# Altium project WT-32 V3.3 LCD.PrjPcb (part 1 of 3)
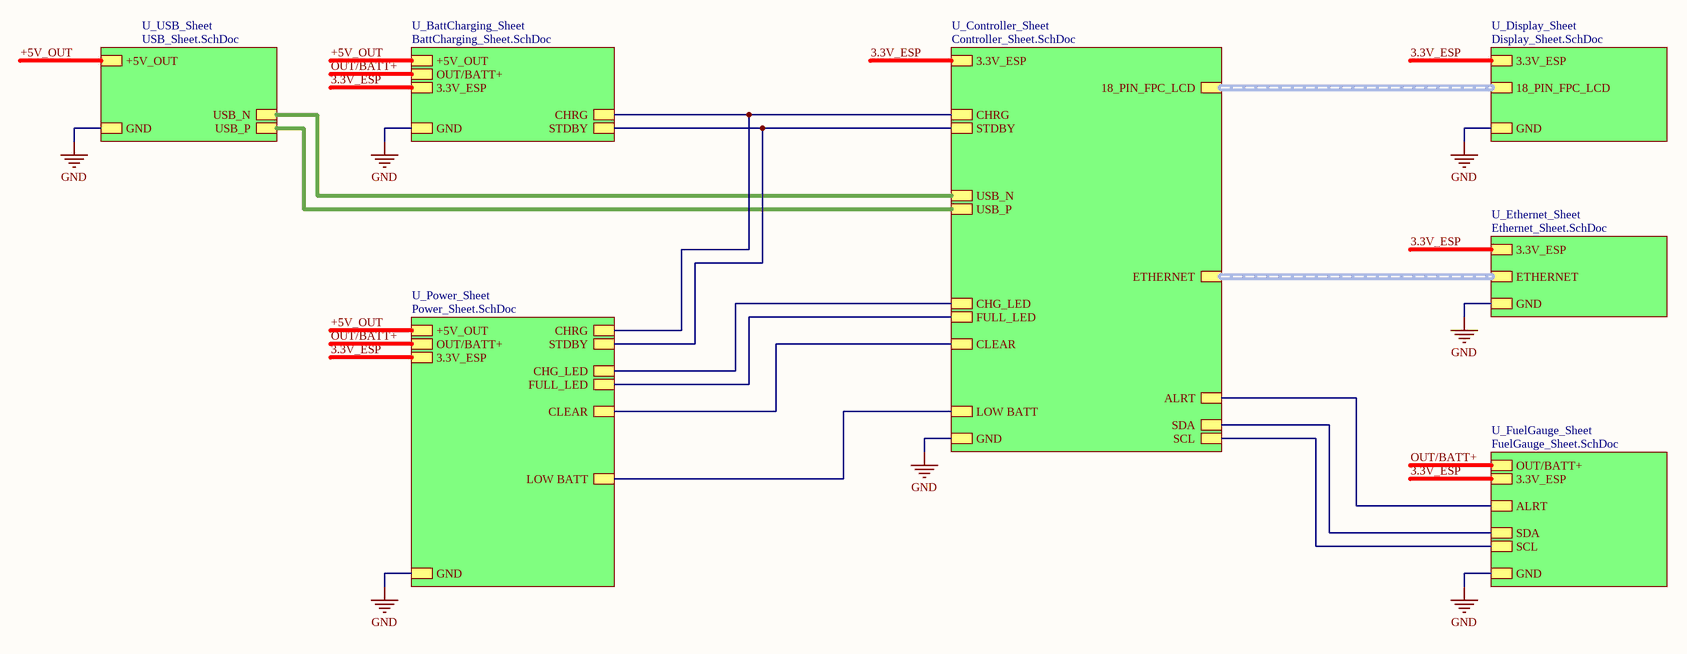
[diagram p0: Top_Sheet.SchDoc]
8 sheets, 129 parts. Net scope: hierarchical (ports join the sheet entries above them; power ports are global).
Board file: Webbie-V3.3.PcbDoc
Sheets:
  Top_Sheet.SchDoc
    U_BattCharging_Sheet = BattCharging_Sheet.SchDoc
    U_Controller_Sheet = Controller_Sheet.SchDoc
    U_Display_Sheet = Display_Sheet.SchDoc
    U_Ethernet_Sheet = Ethernet_Sheet.SchDoc
    U_FuelGauge_Sheet = FuelGauge_Sheet.SchDoc
    U_Power_Sheet = Power_Sheet.SchDoc
    U_USB_Sheet = USB_Sheet.SchDoc

## Sheet Top_Sheet.SchDoc: Top Sheet
size 420 x 297 mm; Engineer: Zain Siddiqui; Revision: V1.0; SheetNumber: 1; SheetTotal: 8

### Sub-sheets
U_BattCharging_Sheet = BattCharging_Sheet.SchDoc: +5V_OUT, GND, OUT/BATT+, 3.3V_ESP, CHRG, STDBY
U_Controller_Sheet = Controller_Sheet.SchDoc: CHRG, STDBY, CHG_LED, FULL_LED, CLEAR, LOW BATT, GND, 3.3V_ESP, 18_PIN_FPC_LCD (harness 18_PIN_FPC_LCD), ALRT, SDA, SCL, ETHERNET (harness ETHERNET), USB_N, USB_P
U_Display_Sheet = Display_Sheet.SchDoc: 18_PIN_FPC_LCD (harness 18_PIN_FPC_LCD), GND, 3.3V_ESP
U_Ethernet_Sheet = Ethernet_Sheet.SchDoc: ETHERNET (harness ETHERNET), GND, 3.3V_ESP
U_FuelGauge_Sheet = FuelGauge_Sheet.SchDoc: ALRT, SDA, SCL, GND, OUT/BATT+, 3.3V_ESP
U_Power_Sheet = Power_Sheet.SchDoc: CHRG, STDBY, +5V_OUT, GND, OUT/BATT+, 3.3V_ESP, CHG_LED, FULL_LED, CLEAR, LOW BATT
U_USB_Sheet = USB_Sheet.SchDoc: USB_N, USB_P, +5V_OUT, GND

### Nets
3.3V_ESP: sheet U_BattCharging_Sheet/3.3V_ESP, sheet U_Controller_Sheet/3.3V_ESP, sheet U_Display_Sheet/3.3V_ESP, sheet U_Ethernet_Sheet/3.3V_ESP, sheet U_FuelGauge_Sheet/3.3V_ESP, sheet U_Power_Sheet/3.3V_ESP
+5V_OUT: sheet U_BattCharging_Sheet/+5V_OUT, sheet U_Power_Sheet/+5V_OUT, sheet U_USB_Sheet/+5V_OUT
GND: sheet U_BattCharging_Sheet/GND, sheet U_Controller_Sheet/GND, sheet U_Display_Sheet/GND, sheet U_Ethernet_Sheet/GND, sheet U_FuelGauge_Sheet/GND, sheet U_Power_Sheet/GND, sheet U_USB_Sheet/GND
OUT/BATT+: sheet U_BattCharging_Sheet/OUT/BATT+, sheet U_FuelGauge_Sheet/OUT/BATT+, sheet U_Power_Sheet/OUT/BATT+
ALRT: sheet U_Controller_Sheet/ALRT, sheet U_FuelGauge_Sheet/ALRT
CHG_LED: sheet U_Controller_Sheet/CHG_LED, sheet U_Power_Sheet/CHG_LED
CHRG: sheet U_BattCharging_Sheet/CHRG, sheet U_Controller_Sheet/CHRG, sheet U_Power_Sheet/CHRG
CLEAR: sheet U_Controller_Sheet/CLEAR, sheet U_Power_Sheet/CLEAR
FULL_LED: sheet U_Controller_Sheet/FULL_LED, sheet U_Power_Sheet/FULL_LED
LOW BATT: sheet U_Controller_Sheet/LOW BATT, sheet U_Power_Sheet/LOW BATT
SCL: sheet U_Controller_Sheet/SCL, sheet U_FuelGauge_Sheet/SCL
SDA: sheet U_Controller_Sheet/SDA, sheet U_FuelGauge_Sheet/SDA
STDBY: sheet U_BattCharging_Sheet/STDBY, sheet U_Controller_Sheet/STDBY, sheet U_Power_Sheet/STDBY
USB_N: sheet U_Controller_Sheet/USB_N, sheet U_USB_Sheet/USB_N
USB_P: sheet U_Controller_Sheet/USB_P, sheet U_USB_Sheet/USB_P

### Buses and harness runs
harness sheet U_Controller_Sheet/18_PIN_FPC_LCD = sheet U_Display_Sheet/18_PIN_FPC_LCD
harness sheet U_Controller_Sheet/ETHERNET = sheet U_Ethernet_Sheet/ETHERNET

### Notes on the sheet
- PROJECT
- TITLE
- DATE
- FILE NAME
- A3
- SIZE
- ENGINEER
- SHEET
- REV
- OF

## Sheet BattCharging_Sheet.SchDoc: Charging Circuit
size 420 x 297 mm; Engineer: Zain Siddiqui; Revision: V1.0; SheetNumber: 3; SheetTotal: 8
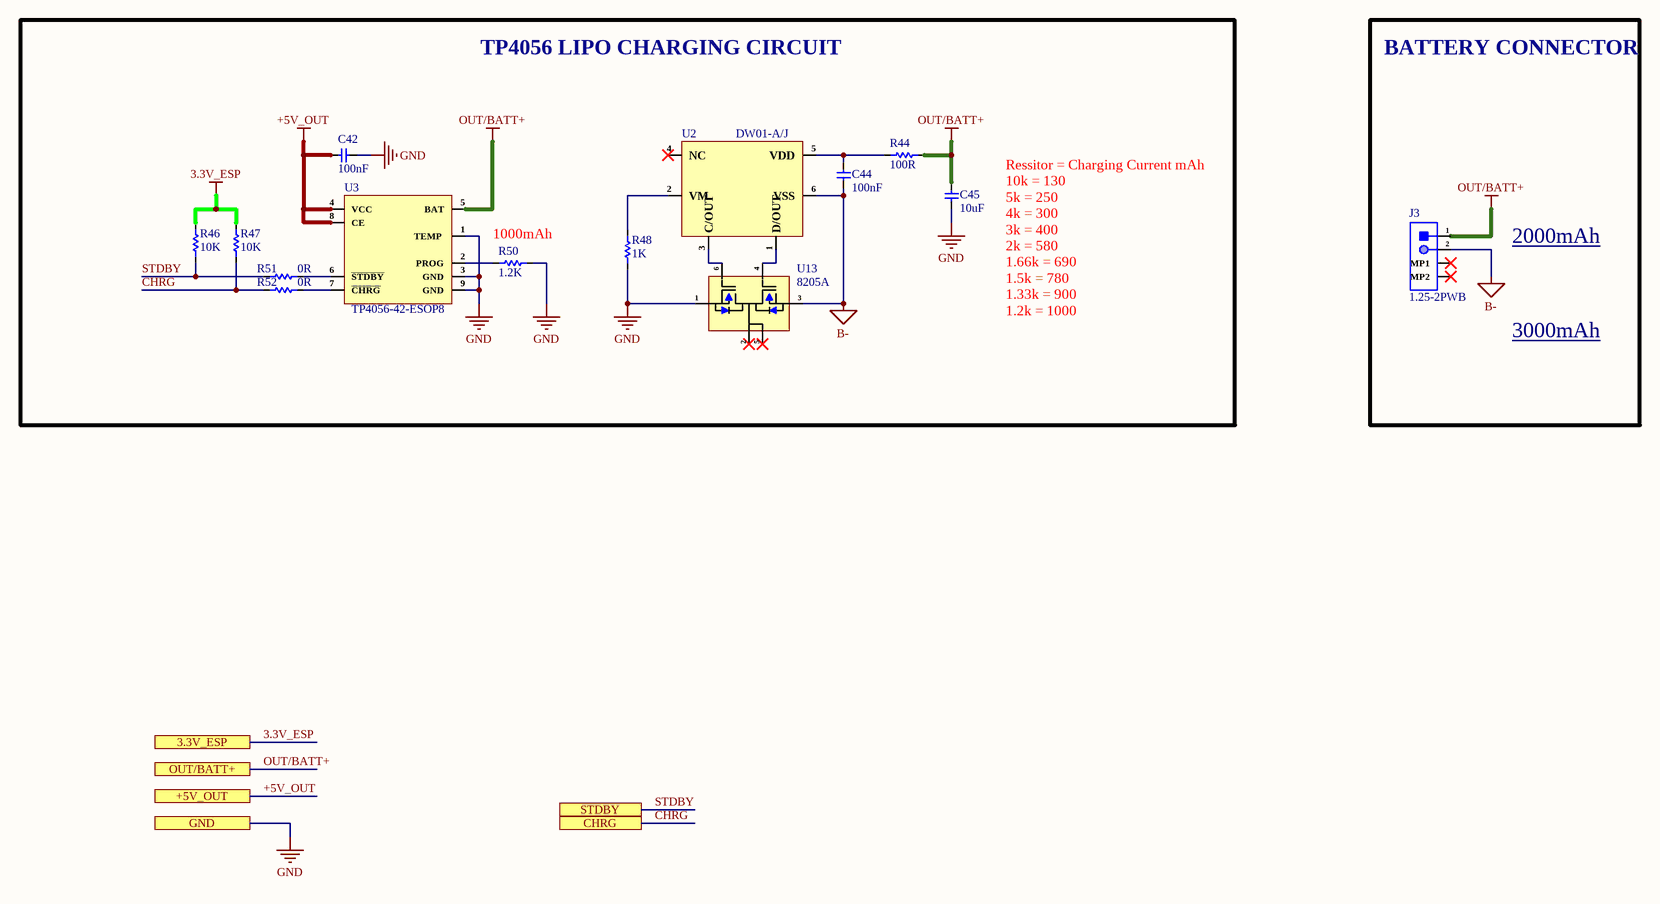
[diagram p1: BattCharging_Sheet.SchDoc]

### Parts
C42  100nF  [cap-0402]
C44  100nF  [cap-0402]
C45  10uF  [Cap-0402]
J3  1.25-2PWB  [1.25-2PWB]
R44  100R  [RES-0805]
R46  10K  [Res-0402]
R47  10K  [Res-0402]
R48  1K  [Res-0402]
R50  1.2K  [Res-0402]
R51  0R  [Res-0402]
R52  0R  [Res-0402]
U2  DW01-A/J  [SOT-23-6]
U3  TP4056-42-ESOP8  [ESOP-8]
U13  8205A  [SOT-23-6]

### Blocks framed on the sheet
TP4056 LIPO CHARGING CIRCUIT: C42 C44 C45 R44 R46-R48 R50-R52 U2 U3 U13

### Ports
3.3V_ESP (see Top_Sheet[2B], Controller_Sheet[3D], Display_Sheet[1D], Ethernet_Sheet[4D], FuelGauge_Sheet[2C], Power_Sheet[1D]), +5V_OUT (see Top_Sheet[2A], Power_Sheet[1D], USB_Sheet[3C]), CHRG (see Top_Sheet[2B], Controller_Sheet[4D], Power_Sheet[2D]), GND (see Top_Sheet[2B], Controller_Sheet[3D], Display_Sheet[1D], Ethernet_Sheet[4D], FuelGauge_Sheet[2C], Power_Sheet[1D], USB_Sheet[3C]), OUT/BATT+ (see Top_Sheet[2A], FuelGauge_Sheet[2C], Power_Sheet[1D]), STDBY (see Top_Sheet[2B], Controller_Sheet[4D], Power_Sheet[2D])

### Nets
3.3V_ESP: R46.2 R47.2 ; port 3.3V_ESP
+5V_OUT: C42.1 U3.4(VCC) U3.8(CE) ; port +5V_OUT
B-: C44.2 J3.2 U2.6(VSS) U13.3(S2)
GND: C42.2 C45.1 R48.1 R50.2 U3.1(TEMP) U3.3(GND) U3.9(GND) U13.1(S1) ; port GND
OUT/BATT+: C45.2 J3.1 R44.2 U3.5(BAT) ; port OUT/BATT+
CHRG: R47.1 R52.1 ; port CHRG
STDBY: R46.1 R51.1 ; port STDBY
NetC44_1: C44.1 R44.1 U2.5(VDD)
NetR48_2: R48.2 U2.2(VM)
NetR50_1: R50.1 U3.2(PROG)
NetR51_2: R51.2 U3.6(~{STDBY})
NetR52_2: R52.2 U3.7(~{CHRG})
NetU2_1: U2.1(D/OUT) U13.4(G2)
NetU2_3: U2.3(C/OUT) U13.6(G1)

Not connected (* = marked no-connect by the designer): J3 MP1* MP2*; U2 4(NC)*; U13 2(D)* 5(D)*

### Notes on the sheet
- BATTERY CONNECTOR
- (near R50) 1000mAh
- 2000mAh <https://www.amazon.co.uk/EEMB-Lithium-103454RP-Rechargeable-Connector/dp/B0B7N2T1TD/?_encoding=UTF8&pd_rd_w=1Q0Rl&content-id=amzn1.sym.a4ac6c4d-6ae7-4d95-b5e0-812c9dcfc72e%3Aamzn1.symc.fc11ad14-99c1-406b-aa77-051d0ba1aade&pf_rd_p=a4ac6c4d-6ae7-4d95-b5e0-812c9dcfc72e&pf_rd_r=75VE4HDA9VR80FP99FPQ&pd_rd_wg=o1fsp&pd_rd_r=b06b78bc-3f15-4724-b1d2-b5be871d7b56&ref_=pd_hp_d_atf_ci_mcx_mr_ca_hp_atf_d>
- Ressitor = Charging Current mAh
  10k = 130
  5k = 250
  4k = 300
  3k = 400
  2k = 580
  1.66k = 690
  1.5k = 780
  1.33k = 900
  1.2k = 1000
- 3000mAh <https://www.amazon.com/gp/product/B0FFM8G9C2/ref=sw_img_1?smid=A1PUYAFTCEEY33&th=1>
- PROJECT
- TITLE
- DATE
- FILE NAME
- A3
- SIZE
- ENGINEER
- SHEET
- REV
- OF

### Library data of the parts
C42 C44 = C1005X7R1H104KT000F: CAP CER 0.1UF 50V X7R 0402; Manufacturer: TDK; Tolerance: 10%; Voltage: 25V; Item Type: Capacitor; Supplier 1: Avnet; Manufacturer Part Number: C1005X7R1H104KT000F; RoHS: No; Category: Ceramic Capacitors; Dielectric: X7R; Supplier Part Number 1: C1005X7R1H104KT000F; LCSC Part Number: C361198; ComponentLink1Description: LCSC; ComponentLink1URL: https://www.lcsc.com/product-detail/Multilayer-Ceramic-Capacitors-MLCC-SMD-SMT_TDK-C1005X7R1H104KT000F_C361198.html
C45 = CL05A106MP5NUNC: CAP CER 10UF 10V X5R 0402; Manufacturer: Samsung; Tolerance: 20%; Item Type: Capacitor; Supplier 1: Avnet; Manufacturer Part Number: CL05A106MP5NUNC; RoHS: Yes; Category: Ceramic Capacitors; Stock 1: 1729850; Pricing 1: 10000=0.02537 (USD); Mount: Surface Mount; Case/Package: 0402; Case Code (Metric): 1005; Case Code (Imperial): 0402; Contact Plating: Tin; Min Operating Temperature: -55°C; Max Operating Temperature: 85°C; Package Quantity: 1; Packaging: Tape and Reel; Capacitance: 10uF; Voltage Rating: 10V; Dielectric: X5R; Termination: Wraparound; Series: CL; Construction: Flat; Length: 1mm; Width: 0.02inch; Thickness: 0.028inch; Depth: 0.5mm; Radiation Hardening: No; Lead Free: Lead Free; RoHS Compliant: Yes; ComponentLink1URL: https://datasheet.ciiva.com/25721/cl05a106mp5nunc-25721584.pdf?src-supplier=Digi-Key; ComponentLink1Description: https://datasheet.ciiva.com/25721/cl05a106mp5nunc-25721584.pdf?src-supplier=Digi-Key; ComponentLink2URL: https://datasheet.ciiva.com/26838/getdatasheetpartid-745310-26838170.pdf?src-supplier=Verical; ComponentLink2Description: https://datasheet.ciiva.com/26838/getdatasheetpartid-745310-26838170.pdf?src-supplier=Verical; Supplier Part Number 1: CL05A106MP5NUNC; LCSC Part Number: C315248
J3 = 1.25-2PWB: 1x2P 1 1.25mm Male pin 2 -40℃~+85℃ Surface Mount SMD,P=1.25mm Wire To Board / Wire To Wire Connector ROHS; Manufacturer: DEALON; Item Type: JST Connector; Manufacturer Part Number: 1.25-2PWB; Package: SMD,P=1.25mm; LCSC Part Number: C2905009; ComponentLink1Description: LCSC; ComponentLink1URL: https://www.lcsc.com/product-detail/Wire-To-Board-Wire-To-Wire-Connector_DEALON-1-25-2PWB_C2905009.html
R44 = AC0805FR-07100RL: RES SMD 100 OHM 1% 1/8W 0805; Manufacturer: Yageo; Item Type: Resistor; Supplier: Future Electronics; Supplier Part Number: 6087312; Manufacturer Part Number: AC0805FR-07100RL; RoHS: Yes; Category: Chip SMD Resistors; Stock: 70000; Pricing: 5000=0.0032, 25000=0.003, 125000=0.0028, 375000=0.0027, 1000000=0.0025 (USD); ComponentLink1URL: https://datasheet.ciiva.com/12656/pyu-ac-51-rohs-l-2-12656967.pdf?src-supplier=Mouser; ComponentLink1Description: https://datasheet.ciiva.com/12656/pyu-ac-51-rohs-l-2-12656967.pdf?src-supplier=Mouser; LCSC Part Number: C138274
R46 R47 = RC0402FR-0710KL: RES 10K OHM 1% 1/16W 0402; Manufacturer: Yageo; Resistance: 10kR; Voltage Rating (DC): 50V; Temperature Coefficient: 100ppm/°C; Power Rating: 62.5mW; Max Power Dissipation: 63mW; Item Type: Resistor; Supplier 1: Mouser; Manufacturer Part Number: RC0402FR-0710KL; RoHS: Yes; Category: Chip SMD Resistors; Stock 1: 18648329; Pricing 1: 1=0.10000, 10=0.01400, 50=0.01400, 100=0.00500, 1000=0.00300, 10000=0.00200 (USD); Case/Package: 0402; Number of Pins: 2; Case Code (Imperial): 0402; Case Code (Metric): 1005; Min Operating Temperature: -55°C; Max Operating Temperature: 155°C; Resistor Type: Thick Film; Tolerance: 1%; Packaging: Tape and Reel; Voltage Rating: 50V; Termination: SMD/SMT; Working Voltage: 50V; Number of Terminations: 2; Features: Moisture Resistant; Series: RC; Resistance Tolerance: 1%; Construction: Rectangular; Length: 1mm; Width: 0.5mm; Height: 0.32mm; Depth: 0.5mm; Lead Pitch: 0.2mm; REACH SVHC: No SVHC; Lead Free: Lead Free; RoHS Compliant: Yes; Military Standard: Not; ComponentLink1URL: https://datasheet.ciiva.com/7660/38568-7660787.pdf?src-supplier=Element14; ComponentLink1Description: https://datasheet.ciiva.com/7660/38568-7660787.pdf?src-supplier=Element14; ComponentLink2URL: https://datasheet.ciiva.com/7849/1686128-7849814.pdf?src-supplier=Element14; ComponentLink2Description: https://datasheet.ciiva.com/7849/1686128-7849814.pdf?src-supplier=Element14; ComponentLink3URL: https://datasheet.ciiva.com/7983/1018594-7983486.pdf?src-supplier=Element14; ComponentLink3Description: https://datasheet.ciiva.com/7983/1018594-7983486.pdf?src-supplier=Element14; ComponentLink4URL: https://datasheet.ciiva.com/22747/1018594-22747512.pdf?src-supplier=Element14; ComponentLink4Description: https://datasheet.ciiva.com/22747/1018594-22747512.pdf?src-supplier=Element14; ComponentLink5URL: https://datasheet.ciiva.com/12667/pyu-rc0402-51-rohs-l-6-r-12667067.pdf?src-supplier=Mouser; ComponentLink5Description: https://datasheet.ciiva.com/12667/pyu-rc0402-51-rohs-l-6-r-12667067.pdf?src-supplier=Mouser; ComponentLink6URL: https://datasheet.ciiva.com/7849/1784430-7849813.pdf?src-supplier=Element14; ComponentLink6Description: https://datasheet.ciiva.com/7849/1784430-7849813.pdf?src-supplier=Element14; ComponentLink7URL: https://datasheet.ciiva.com/7849/1784430-7849815.pdf?src-supplier=Element14; ComponentLink7Description: https://datasheet.ciiva.com/7849/1784430-7849815.pdf?src-supplier=Element14; Supplier Part Number 1: 603-RC0402FR-0710KL; LCSC Part Number: C60490
R48 = CRCW04021K00FKEDHP: RES SMD 1K OHM 1% 1/5W 0402; Manufacturer: Vishay Dale; Resistance: 1kR; Temperature Coefficient: 100ppm/°C; Power Rating: 125mW; Voltage Rating: 50V; Supplier 1: Digi-Key; Manufacturer Part Number: CRCW04021K00FKEDHP; Stock 1: 315989; Pricing 1: 1=0.15, 10=0.132, 100=0.0506, 1000=0.02226, 2500=0.01923, 5000=0.0172 (USD); Mount: Surface Mount; Case/Package: 0402; Number of Pins: 2; Contact Plating: Tin; Weight: 2.3E-05oz; Case Code (Imperial): 0402; Case Code (Metric): 1005; Size Code: 0402; Min Operating Temperature: -55°C; Max Operating Temperature: 155°C; Tolerance: 1%; Resistor Type: Thick Film; Package Quantity: 10; Packaging: Tape and Reel; Number of Terminations: 2; Termination: SMD/SMT; Max Power Dissipation: 125mW; Voltage Rating (DC): 50V; Features: Automotive AEC-Q200; Series: CRCW-HP; Construction: Rectangular; Technology: THICK FILM; Resistance Tolerance: 1%; Length: 1mm; Width: 0.5mm; Height: 0.3mm; Depth: 0.5mm; Radiation Hardening: No; REACH SVHC: Unknown; Military Standard: Not; Lead Free: Lead Free; RoHS Compliant: Yes; ComponentLink1URL: http://www.farnell.com/datasheets/2339608.pdf?src-supplier=Element14; ComponentLink1Description: http://www.farnell.com/datasheets/2339608.pdf?src-supplier=Element14; ComponentLink2URL: http://www.vishay.com/docs/20043/crcwhpe3.pdf?src-supplier=Digi-Key; ComponentLink2Description: http://www.vishay.com/docs/20043/crcwhpe3.pdf?src-supplier=Digi-Key; ComponentLink3URL: http://www.mouser.com/ds/2/427/crcwhpe3-46056.pdf?src-supplier=Mouser; ComponentLink3Description: http://www.mouser.com/ds/2/427/crcwhpe3-46056.pdf?src-supplier=Mouser; ComponentLink4URL: http://www.vishay.com/docs/20043/crcwhpe3.pdf?src-supplier=Avnet; ComponentLink4Description: http://www.vishay.com/docs/20043/crcwhpe3.pdf?src-supplier=Avnet; ComponentLink5URL: http://www.vishay.com/docs/20043/crcwhpe3.pdf?src-supplier=Future+Electronics; ComponentLink5Description: http://www.vishay.com/docs/20043/crcwhpe3.pdf?src-supplier=Future+Electronics; Supplier Part Number 1: 541-1.00KYCT-ND; LCSC Part Number: C313354
R50 = RC0402FR-071K2L: RES 1.2K OHM 1% 1/16W 0402; Manufacturer: Yageo; Resistance: 1.2kR; Power Rating: 63mW; Voltage Rating: 50V; Temperature Coefficient: 100ppm/°C; Item Type: Resistor; Supplier 1: Avnet; Manufacturer Part Number: RC0402FR-071K2L; RoHS: Yes; Category: Chip SMD Resistors; Stock 1: 170000; Pricing 1: 10000=0.00085 (USD); Case/Package: 0402; Case Code (Imperial): 0402; Case Code (Metric): 1005; Size Code: 0402; Min Operating Temperature: -55°C; Max Operating Temperature: 155°C; Tolerance: 1%; Packaging: Tape and Reel; Package Quantity: 1; Termination: SMD/SMT; Resistor Type: Thick Film; Number of Terminations: 2; Max Power Dissipation: 63mW; Features: Moisture Resistant; Series: RC; Construction: Rectangular; Resistance Tolerance: 1%; Technology: THICK FILM; Length: 0.039inch; Width: 0.02inch; Height: 0.016inch; Depth: 0.5mm; Military Standard: Not; Lead Free: Lead Free; RoHS Compliant: Yes; ComponentLink1URL: https://datasheet.ciiva.com/11808/0900766b80c66297-11808455.pdf?src-supplier=RSComponents; ComponentLink1Description: https://datasheet.ciiva.com/11808/0900766b80c66297-11808455.pdf?src-supplier=RSComponents; ComponentLink2URL: https://datasheet.ciiva.com/2453/pyu-r-int-thick-7-2453467.pdf?src-supplier=Digi-Key; ComponentLink2Description: https://datasheet.ciiva.com/2453/pyu-r-int-thick-7-2453467.pdf?src-supplier=Digi-Key; ComponentLink3URL: https://datasheet.ciiva.com/2453/pyu-r-int-thick-7-2453468.pdf?src-supplier=Digi-Key; ComponentLink3Description: https://datasheet.ciiva.com/2453/pyu-r-int-thick-7-2453468.pdf?src-supplier=Digi-Key; ComponentLink4URL: https://datasheet.ciiva.com/2453/pyu-r-int-thick-7-2453466.pdf?src-supplier=Digi-Key; ComponentLink4Description: https://datasheet.ciiva.com/2453/pyu-r-int-thick-7-2453466.pdf?src-supplier=Digi-Key; ComponentLink5URL: https://datasheet.ciiva.com/7849/1018594-7849861.pdf?src-supplier=Element14; ComponentLink5Description: https://datasheet.ciiva.com/7849/1018594-7849861.pdf?src-supplier=Element14; ComponentLink6URL: https://datasheet.ciiva.com/7849/1018594-7849862.pdf?src-supplier=Element14; ComponentLink6Description: https://datasheet.ciiva.com/7849/1018594-7849862.pdf?src-supplier=Element14; ComponentLink7URL: https://datasheet.ciiva.com/15189/getdatasheetpartid-323716-15189366.pdf?src-supplier=Verical; ComponentLink7Description: https://datasheet.ciiva.com/15189/getdatasheetpartid-323716-15189366.pdf?src-supplier=Verical; ComponentLink8URL: https://datasheet.ciiva.com/16745/pyu-rc0402-51-rohs-l-6-r-16745005.pdf?src-supplier=Future+Electronics; ComponentLink8Description: https://datasheet.ciiva.com/16745/pyu-rc0402-51-rohs-l-6-r-16745005.pdf?src-supplier=Future+Electronics; Supplier Part Number 1: RC0402FR-071K2L; LCSC Part Number: C138040
R51 R52 = RC0402FR-070RL: RES 0 OHM JUMPER 1/16W 0402; Manufacturer: Yageo; Item Type: Resistors; Tolerance: 1%; Power Rating: 62.5mW; Voltage Rating: 50V; Temperature Coefficient: 200ppm/°C; Max Power Dissipation: 63mW; Supplier 1: Mouser; Manufacturer Part Number: RC0402FR-070RL; RoHS: Yes; Stock 1: 8556842; Pricing 1: 1=0.10000, 10=0.01400, 50=0.01400, 100=0.00600, 1000=0.00300, 5000=0.00200, 10000=0.00100 (USD); Mount: Surface Mount; Case/Package: 0402; Contact Plating: Tin,Matte; Case Code (Imperial): 0402; Case Code (Metric): 1005; Size Code: 0402; Min Operating Temperature: -55°C; Max Operating Temperature: 155°C; Resistance: 0R; Resistor Type: Thick Film; Packaging: Tape and Reel; Termination: SMD/SMT; Features: Moisture Resistant; Series: RC; Number of Terminations: 2; Length: 1mm; Width: 0.5mm; Height: 0.35mm; Radiation Hardening: No; Lead Free: Lead Free; RoHS Compliant: Yes; ComponentLink1URL: https://datasheet.ciiva.com/8896/pyu-rc0402-51-rohs-l-6-8896149.pdf?src-supplier=Avnet; ComponentLink1Description: https://datasheet.ciiva.com/8896/pyu-rc0402-51-rohs-l-6-8896149.pdf?src-supplier=Avnet; ComponentLink2URL: https://datasheet.ciiva.com/16790/pyu-rc0402-51-rohs-l-6-r-16790444.pdf?src-supplier=Future+Electronics; ComponentLink2Description: https://datasheet.ciiva.com/16790/pyu-rc0402-51-rohs-l-6-r-16790444.pdf?src-supplier=Future+Electronics; Supplier Part Number 1: 603-RC0402FR-070RL; LCSC Part Number: C106231
U2 = DW01-A/J: SOT-23-6 Battery Management ROHS; Manufacturer: Shenzhen Fuman Elec; Item Type: IC; Manufacturer Part Number: DW01-A/J; Package: SOT-23-6; LCSC Part Number: C2909013; ComponentLink1Description: LCSC; ComponentLink1URL: https://www.lcsc.com/product-detail/Battery-Management_Shenzhen-Fuman-Elec-DW01-A-J_C2909013.html
U3 = TP4056-42-ESOP8: ESOP-8 Battery Management ICs ROHS; Manufacturer: TOPPOWER; Item Type: IC; Manufacturer Part Number: TP4056-42-ESOP8; Package: ESOP-8; LCSC Part Number: C16581; ComponentLink1Description: LCSC; ComponentLink1URL: https://www.lcsc.com/product-detail/Battery-Management-ICs_TOPPOWER-Nanjing-Extension-Microelectronics-TP4056-42-ESOP8_C16581.html
U13 = 8205A: 20V 5A 36mΩ@2.5V,3A 830mW 1.2V@250uA 2 N-Channel SOT-23-6 MOSFETs ROHS; Manufacturer: UMW; Item Type: IC; ComponentLink1Description: LCSC; ComponentLink1URL: https://www.lcsc.com/product-detail/MOSFETs_UMW-Youtai-Semiconductor-Co-Ltd-8205A_C351449.html; Manufacturer Part Number: 8205A; Package: SOT-23-6; LCSC Part Number: C351449

## Sheet Controller_Sheet.SchDoc: Controller
size 420 x 297 mm; Engineer: Zain Siddiqui; Revision: V3.2; SheetNumber: 5; SheetTotal: 8
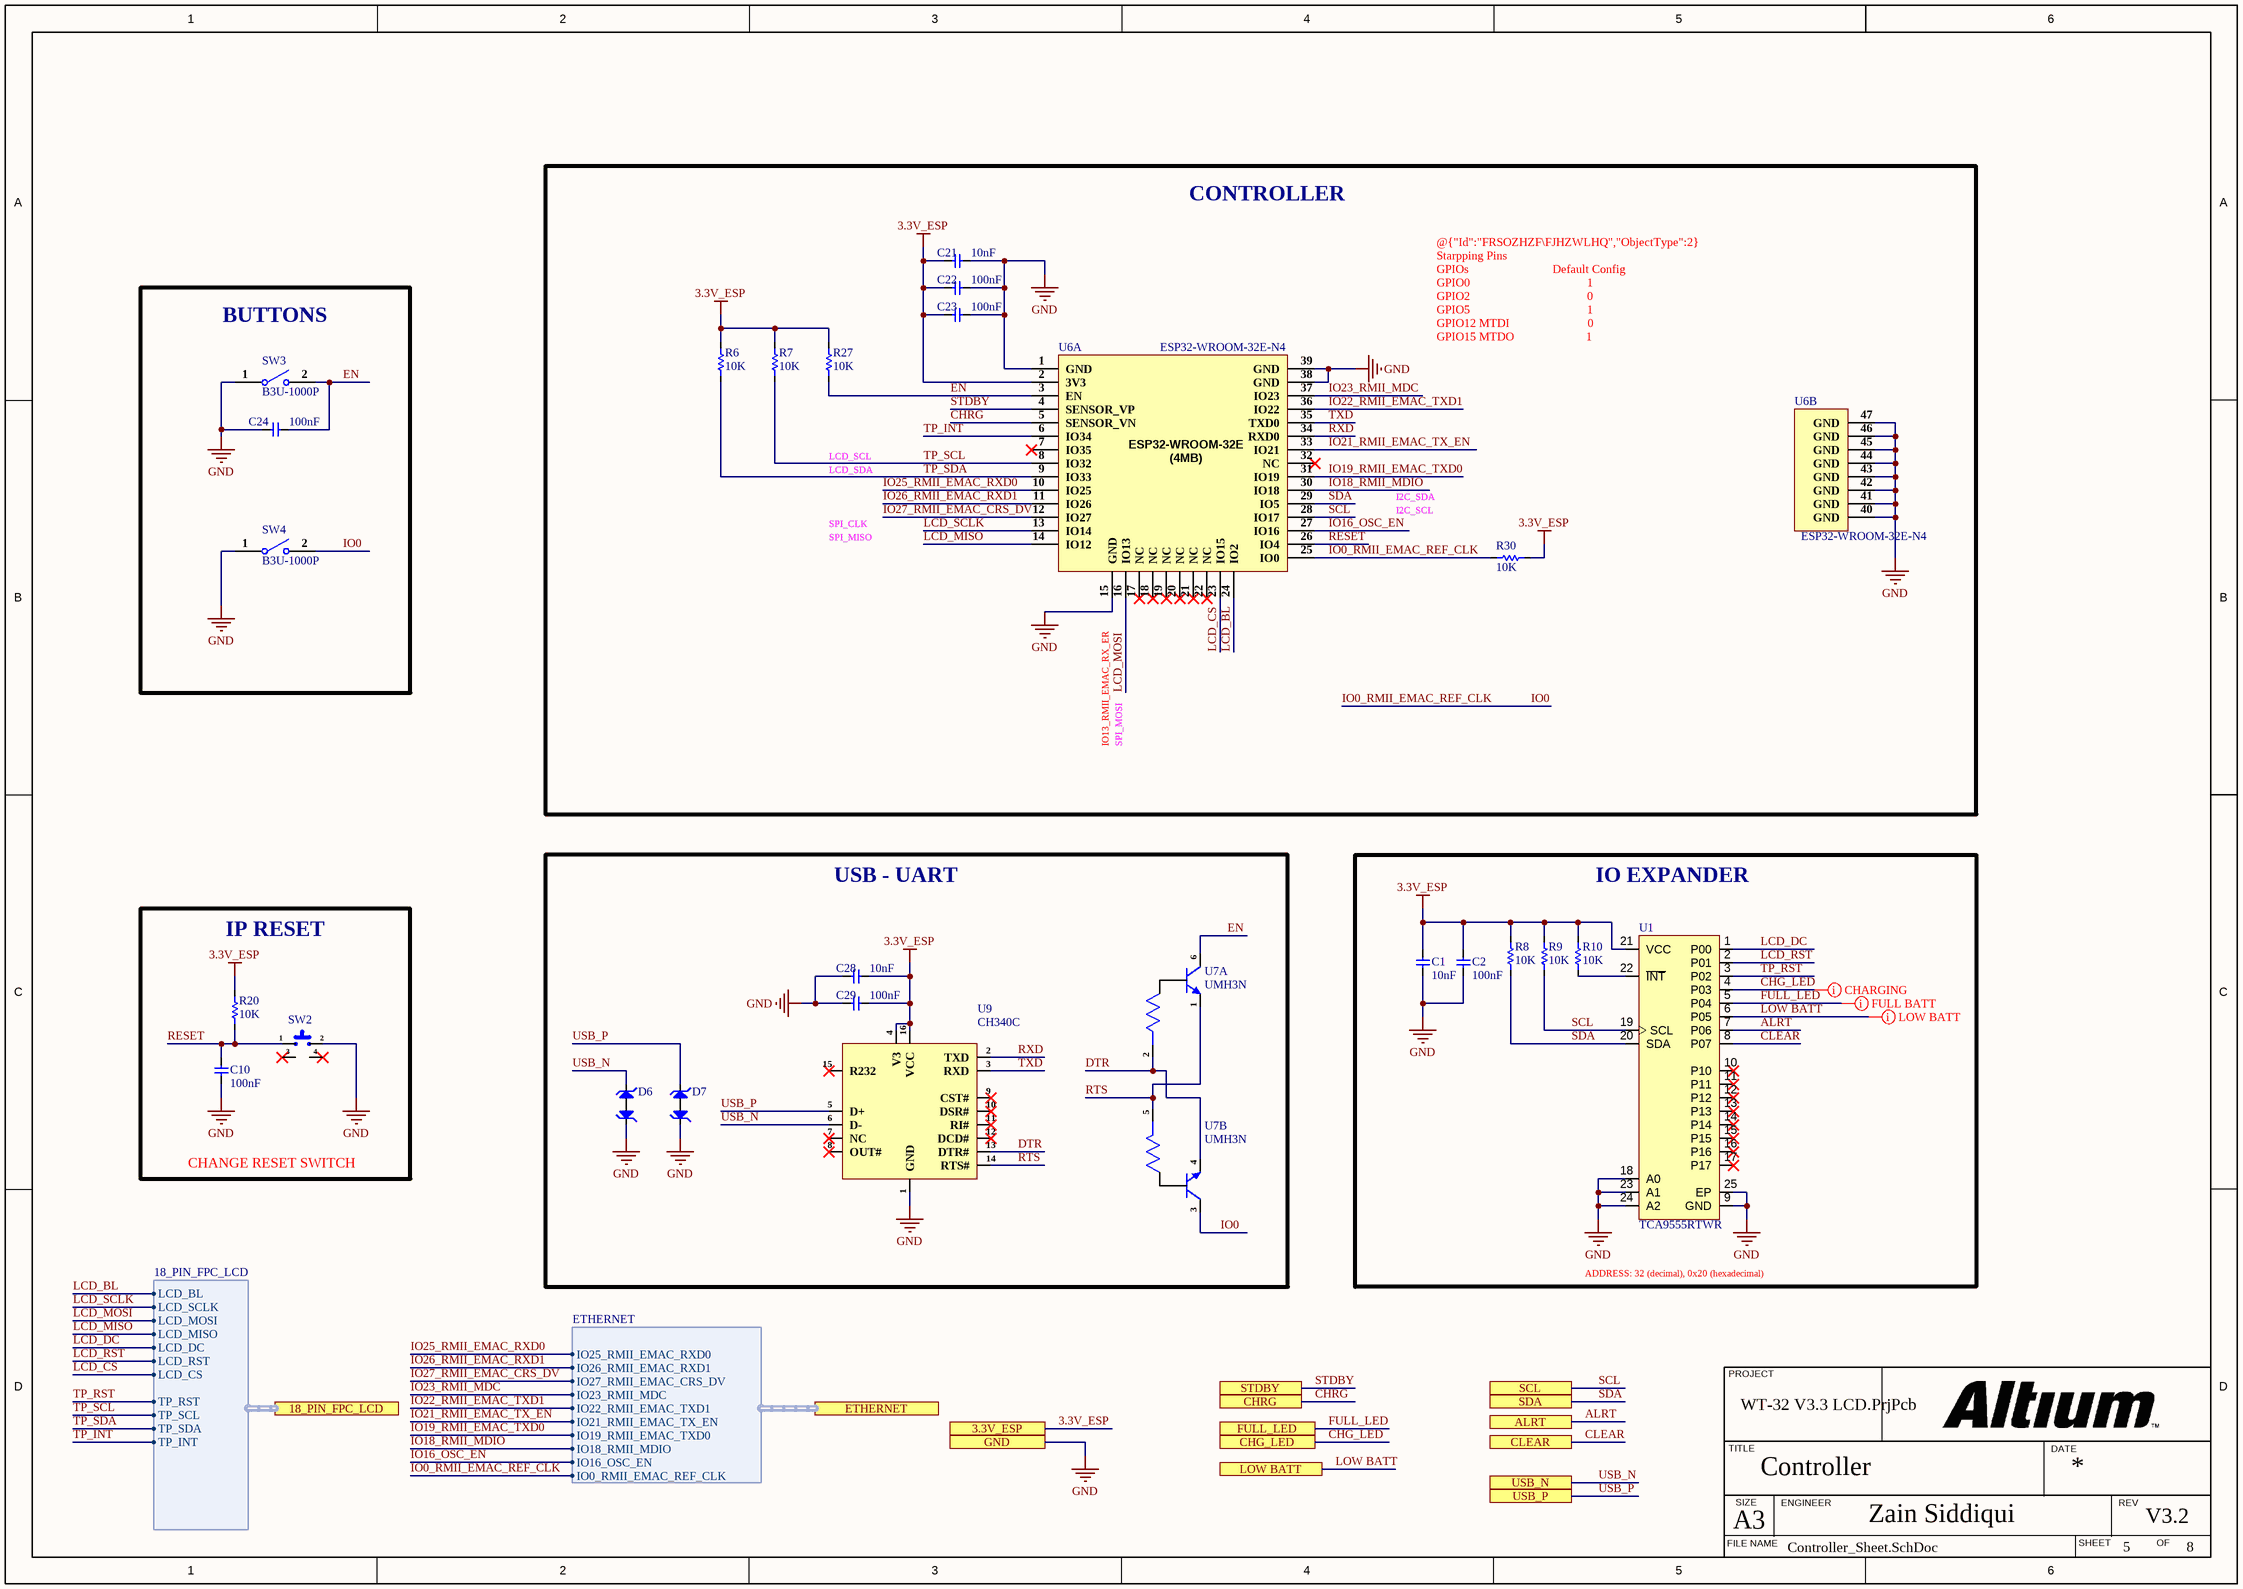
[diagram p2: Controller_Sheet.SchDoc]

### Parts
C1  10nF  [Cap-0402]
C2  100nF  [cap-0402]
C10  100nF  [cap-0402]
C21  10nF  [Cap-0402]
C22  100nF  [cap-0402]
C23  100nF  [cap-0402]
C24  100nF  [cap-0402]
C28  10nF  [Cap-0402]
C29  100nF  [cap-0402]
D6  PESD5V0H1BSFYL  [DSN0603-2]  (value not drawn)
D7  PESD5V0H1BSFYL  [DSN0603-2]  (value not drawn)
R6  10K  [Res-0402]
R7  10K  [Res-0402]
R8  10K  [Res-0402]
R9  10K  [Res-0402]
R10  10K  [Res-0402]
R20  10K  [Res-0402]
R27  10K  [Res-0402]
R30  10K  [Res-0402]
SW2  TC-6615-9.5-260G  [TC-6615-9.5-260G]  (value not drawn)
SW3  B3U-1000P  [B3U-1000P]
SW4  B3U-1000P  [B3U-1000P]
U1  TCA9555RTWR  [WQFN-24-EP(4x4)]
U6  ESP32-WROOM-32E-N4  [38-SMD Module]  (parts A,B of 2)
U7  UMH3N  [SC-70-6_]  (parts A,B of 2)
U9  CH340C  [SOP-16]

### Blocks framed on the sheet
CONTROLLER: C21-C23 R6 R7 R27 R30 U6
BUTTONS: C24 SW3 SW4
USB - UART: C28 C29 D6 D7 U7 U9
IO EXPANDER: C1 C2 R8-R10 U1
IP RESET: C10 R20 SW2

### Ports
3.3V_ESP (see Top_Sheet[3A], BattCharging_Sheet[2D], Display_Sheet[1D], Ethernet_Sheet[4D], FuelGauge_Sheet[2C], Power_Sheet[1D]), 18_PIN_FPC_LCD (harness 18_PIN_FPC_LCD, see Top_Sheet[4B], Display_Sheet[3D]), ALRT (see Top_Sheet[4B], FuelGauge_Sheet[3C]), CHG_LED (see Top_Sheet[3B], Power_Sheet[2D]), CHRG (see Top_Sheet[3B], BattCharging_Sheet[3D], Power_Sheet[2D]), CLEAR (see Top_Sheet[3B], Power_Sheet[2D]), ETHERNET (harness ETHERNET, see Top_Sheet[4B], Ethernet_Sheet[6D]), FULL_LED (see Top_Sheet[3B], Power_Sheet[2D]), GND (see Top_Sheet[3B], BattCharging_Sheet[2D], Display_Sheet[1D], Ethernet_Sheet[4D], FuelGauge_Sheet[2C], Power_Sheet[1D], USB_Sheet[3C]), LOW BATT (see Top_Sheet[3B], Power_Sheet[2D]), SCL (see Top_Sheet[4B], FuelGauge_Sheet[3C]), SDA (see Top_Sheet[4B], FuelGauge_Sheet[3C]), STDBY (see Top_Sheet[3B], BattCharging_Sheet[3D], Power_Sheet[2D]), USB_N (see Top_Sheet[3B], USB_Sheet[3C]), USB_P (see Top_Sheet[3B], USB_Sheet[3C])

### Harnesses
18_PIN_FPC_LCD: LCD_BL, LCD_SCLK, LCD_MOSI, LCD_MISO, LCD_DC, LCD_RST, LCD_CS, TP_RST, TP_SCL, TP_SDA, TP_INT
ETHERNET: IO25_RMII_EMAC_RXD0, IO26_RMII_EMAC_RXD1, IO27_RMII_EMAC_CRS_DV, IO23_RMII_MDC, IO22_RMII_EMAC_TXD1, IO21_RMII_EMAC_TX_EN, IO19_RMII_EMAC_TXD0, IO18_RMII_MDIO, IO16_OSC_EN, IO0_RMII_EMAC_REF_CLK

### Nets
3.3V_ESP: C1.1 C2.1 C21.2 C22.2 C23.2 C28.1 C29.1 R6.2 R7.2 R8.2 R9.2 R10.2 R20.2 R27.2 R30.2 U1.21(VCC) U6.2(3V3) U9.4(V3) U9.16(VCC) ; port 3.3V_ESP
GND: C1.2 C2.2 C10.2 C21.1 C22.1 C23.1 C24.2 C28.2 C29.2 D6.1 D7.1 SW2.2 SW3.1 SW4.1 U1.9(GND) U1.18(A0) U1.23(A1) U1.24(A2) U1.25(EP) U6.1(GND) U6.15(GND) U6.38(GND) U6.39(GND) U6.40(GND) U6.41(GND) U6.42(GND) U6.43(GND) U6.44(GND) U6.45(GND) U6.46(GND) U6.47(GND) U9.1(GND) ; port GND
ALRT: U1.7(P06) ; port ALRT
CHG_LED: U1.4(P03) ; port CHG_LED
CHRG: U6.5(SENSOR_VN) ; port CHRG
CLEAR: U1.8(P07) ; port CLEAR
DTR: U7.2 U7.4(E) U9.13(DTR#)
EN: C24.1 R27.1 SW3.2 U6.3(EN) U7.6(C)
FULL_LED: U1.5(P04) ; port FULL_LED
IO0: R30.1 SW4.2 U6.25(IO0) U7.3(C) ; port ETHERNET.IO0_RMII_EMAC_REF_CLK  [also labelled IO0_RMII_EMAC_REF_CLK]
IO16_OSC_EN: U6.27(IO16) ; port ETHERNET.IO16_OSC_EN
IO18_RMII_MDIO: U6.30(IO18) ; port ETHERNET.IO18_RMII_MDIO
IO19_RMII_EMAC_TXD0: U6.31(IO19) ; port ETHERNET.IO19_RMII_EMAC_TXD0
IO21_RMII_EMAC_TX_EN: U6.33(IO21) ; port ETHERNET.IO21_RMII_EMAC_TX_EN
IO22_RMII_EMAC_TXD1: U6.36(IO22) ; port ETHERNET.IO22_RMII_EMAC_TXD1
IO23_RMII_MDC: U6.37(IO23) ; port ETHERNET.IO23_RMII_MDC
IO25_RMII_EMAC_RXD0: U6.10(IO25) ; port ETHERNET.IO25_RMII_EMAC_RXD0
IO26_RMII_EMAC_RXD1: U6.11(IO26) ; port ETHERNET.IO26_RMII_EMAC_RXD1
IO27_RMII_EMAC_CRS_DV: U6.12(IO27) ; port ETHERNET.IO27_RMII_EMAC_CRS_DV
LCD_BL: U6.24(IO2) ; port 18_PIN_FPC_LCD.LCD_BL
LCD_CS: U6.23(IO15) ; port 18_PIN_FPC_LCD.LCD_CS
LCD_DC: U1.1(P00) ; port 18_PIN_FPC_LCD.LCD_DC
LCD_MISO: U6.14(IO12) ; port 18_PIN_FPC_LCD.LCD_MISO
LCD_MOSI: U6.16(IO13) ; port 18_PIN_FPC_LCD.LCD_MOSI
LCD_RST: U1.2(P01) ; port 18_PIN_FPC_LCD.LCD_RST
LCD_SCLK: U6.13(IO14) ; port 18_PIN_FPC_LCD.LCD_SCLK
LOW BATT: U1.6(P05) ; port LOW BATT
RESET: C10.1 R20.1 SW2.1 U6.26(IO4)
RTS: U7.1(E) U7.5 U9.14(RTS#)
RXD: U6.34(RXD0) U9.2(TXD)
SCL: R9.1 U1.19(SCL) U6.28(IO17) ; port SCL
SDA: R8.1 U1.20(SDA) U6.29(IO5) ; port SDA
STDBY: U6.4(SENSOR_VP) ; port STDBY
TP_INT: U6.6(IO34) ; port 18_PIN_FPC_LCD.TP_INT
TP_RST: U1.3(P02) ; port 18_PIN_FPC_LCD.TP_RST
TP_SCL: R7.1 U6.8(IO32) ; port 18_PIN_FPC_LCD.TP_SCL
TP_SDA: R6.1 U6.9(IO33) ; port 18_PIN_FPC_LCD.TP_SDA
TXD: U6.35(TXD0) U9.3(RXD)
USB_N: D6.2 U9.6(D-) ; port USB_N
USB_P: D7.2 U9.5(D+) ; port USB_P
NetR10_1: R10.1 U1.22(~{INT})

Not connected (* = marked no-connect by the designer): SW2 3* 4*; U1 10(P10)* 11(P11)* 12(P12)* 13(P13)* 14(P14)* 15(P15)* 16(P16)* 17(P17)*; U6 7(IO35)* 17(NC)* 18(NC)* 19(NC)* 20(NC)* 21(NC)* 22(NC)* 32(NC)*; U9 7(NC)* 8(OUT#)* 9(CST#)* 10(DSR#)* 11(RI#)* 12(DCD#)* 15(R232)*

### Layout directives
mark named LOW BATT: LOW BATT
mark named CHARGING: CHG_LED
mark named FULL BATT: FULL_LED

### Notes on the sheet
- @{"Id":"FRSOZHZF\FJHZWLHQ","ObjectType":2} Starpping Pins
  GPIOs                            Default Config
  GPIO0                                       1
  GPIO2                                       0
  GPIO5                                       1
  GPIO12 MTDI                          0
  GPIO15 MTDO                        1
- LCD_SCL
- SPI_CLK
- LCD_SDA
- I2C_SCL
- I2C_SDA
- SPI_MISO
- IO13_RMII_EMAC_RX_ER
- SPI_MOSI
- CHANGE RESET SWITCH
- ADDRESS: 32 (decimal), 0x20 (hexadecimal)
- PROJECT
- TITLE
- DATE
- FILE NAME
- A3
- SIZE
- ENGINEER
- SHEET
- REV
- OF
- (in symbol ESP32-WROOM-32E-N4, part A) ESP32-WROOM-32E (4MB) /

### Library data of the parts
C1 C21 C28 = CC0402KRX7R8BB103: CAP CER 10000PF 25V X7R 0402; Manufacturer: Yageo; Tolerance: 10%; Item Type: Capacitor; Supplier 1: Digi-Key; Manufacturer Part Number: CC0402KRX7R8BB103; Stock 1: 0; Pricing 1: 1=0.1, 10=0.021, 100=0.0093, 500=0.00666, 1000=0.00523, 2500=0.00476, 5000=0.00438 (USD); Mount: Surface Mount; Case/Package: 0402; Case Code (Metric): 1005; Case Code (Imperial): 0402; Min Operating Temperature: -55°C; Max Operating Temperature: 125°C; Capacitance: 10nF; Dielectric: X7R; Voltage Rating: 25V; Package Quantity: 1; Packaging: Tape and Reel; Voltage Rating (DC): 25V; Termination: SMD/SMT; Composition: Ceramic; Length: 1mm; Height: 0.5mm; Depth: 0.5mm; Width: 0.02inch; Thickness: 0.022inch; Radiation Hardening: No; REACH SVHC: Unknown; Lead Free: Lead Free; Halogen Free: Halogen Free; ComponentLink1URL: http://www.yageo.com/documents/recent/UPY-GPHC_X7R_6.3V-to-50V_18.pdf?src-supplier=Digi-Key; ComponentLink1Description: http://www.yageo.com/documents/recent/UPY-GPHC_X7R_6.3V-to-50V_18.pdf?src-supplier=Digi-Key; ComponentLink2URL: https://www.verical.com/server-webapp/html/getDatasheet?partID=375418&src-supplier=Verical; ComponentLink2Description: https://www.verical.com/server-webapp/html/getDatasheet?partID=375418&src-supplier=Verical; ComponentLink3URL: http://www.yageo.com/documents/recent/UPY-GPHC_X7R_6.3V-to-50V_8.pdf?src-supplier=Avnet; ComponentLink3Description: http://www.yageo.com/documents/recent/UPY-GPHC_X7R_6.3V-to-50V_8.pdf?src-supplier=Avnet; ComponentLink4URL: https://4donline.ihs.com/images/VipMasterIC/IC/YAGO/YAGO-S-A0003557223/YAGO-S-A0003557223-1.pdf?hkey=52A5661711E402568146F3353EA87419&src-supplier=Element14; ComponentLink4Description: https://4donline.ihs.com/images/VipMasterIC/IC/YAGO/YAGO-S-A0003557223/YAGO-S-A0003557223-1.pdf?hkey=52A5661711E402568146F3353EA87419&src-supplier=Element14; ComponentLink5URL: http://www.farnell.com/datasheets/2167236.pdf?src-supplier=Element14; ComponentLink5Description: http://www.farnell.com/datasheets/2167236.pdf?src-supplier=Element14; ComponentLink6URL: http://www.mouser.com/ds/2/447/Yageo_UPY-GP_NP0_16V-to-50V_9-358835.pdf?src-supplier=Mouser; ComponentLink6Description: http://www.mouser.com/ds/2/447/Yageo_UPY-GP_NP0_16V-to-50V_9-358835.pdf?src-supplier=Mouser; Supplier Part Number 1: 311-1337-1-ND; LCSC Part Number: C327025
C2 C10 C22-C24 C29 = C1005X7R1H104KT000F: as C42 on sheet BattCharging_Sheet; Supplier 1: Avnet; Manufacturer Part Number: C1005X7R1H104KT000F; RoHS: No; Category: Ceramic Capacitors; Dielectric: X7R; Supplier Part Number 1: C1005X7R1H104KT000F; LCSC Part Number: C361198; ComponentLink1Description: LCSC; ComponentLink1URL: https://www.lcsc.com/product-detail/Multilayer-Ceramic-Capacitors-MLCC-SMD-SMT_TDK-C1005X7R1H104KT000F_C361198.html
D6 D7 = PESD5V0H1BSFYL: TVS DIODE 5VWM 6.3VC DSN0603-2; Manufacturer: Nexperia; Supplier 1: Avnet; Manufacturer Part Number: PESD5V0H1BSFYL; RoHS: Yes; Category: ESD and Circuit Protection ICs; Stock 1: 9000; Pricing 1: 18000=0.06453, 36000=0.06278, 54000=0.06104, 90000=0.05930, 180000=0.05755, 900000=0.05581, 1800000=0.05406 (USD); RoHS Compliant: Yes; ComponentLink1URL: http://www.farnell.com/datasheets/1961312.pdf?src-supplier=Farnell; ComponentLink1Description: http://www.farnell.com/datasheets/1961312.pdf?src-supplier=Farnell; ComponentLink2URL: https://assets.nexperia.com/documents/data-sheet/PESD5V0H1BSF.pdf?src-supplier=Digi-Key; ComponentLink2Description: https://assets.nexperia.com/documents/data-sheet/PESD5V0H1BSF.pdf?src-supplier=Digi-Key; ComponentLink3URL: http://www.farnell.com/datasheets/1961312.pdf?src-supplier=Newark; ComponentLink3Description: http://www.farnell.com/datasheets/1961312.pdf?src-supplier=Newark; Supplier Part Number 1: PESD5V0H1BSFYL; LCSC Part Number: C477989; Item Type: Diode
R6-R10 R20 R27 R30 = RC0402FR-0710KL: as R46 on sheet BattCharging_Sheet; Supplier 1: Mouser; Manufacturer Part Number: RC0402FR-0710KL; RoHS: Yes; Category: Chip SMD Resistors; Stock 1: 18648329; Pricing 1: 1=0.10000, 10=0.01400, 50=0.01400, 100=0.00500, 1000=0.00300, 10000=0.00200 (USD); Case/Package: 0402; Number of Pins: 2; Case Code (Imperial): 0402; Case Code (Metric): 1005; Min Operating Temperature: -55°C; Max Operating Temperature: 155°C; Resistor Type: Thick Film; Tolerance: 1%; Packaging: Tape and Reel; Voltage Rating: 50V; Termination: SMD/SMT; Working Voltage: 50V; Number of Terminations: 2; Features: Moisture Resistant; Series: RC; Resistance Tolerance: 1%; Construction: Rectangular; Length: 1mm; Width: 0.5mm; Height: 0.32mm; Depth: 0.5mm; Lead Pitch: 0.2mm; REACH SVHC: No SVHC; Lead Free: Lead Free; RoHS Compliant: Yes; Military Standard: Not; ComponentLink1URL: https://datasheet.ciiva.com/7660/38568-7660787.pdf?src-supplier=Element14; ComponentLink1Description: https://datasheet.ciiva.com/7660/38568-7660787.pdf?src-supplier=Element14; ComponentLink2URL: https://datasheet.ciiva.com/7849/1686128-7849814.pdf?src-supplier=Element14; ComponentLink2Description: https://datasheet.ciiva.com/7849/1686128-7849814.pdf?src-supplier=Element14; ComponentLink3URL: https://datasheet.ciiva.com/7983/1018594-7983486.pdf?src-supplier=Element14; ComponentLink3Description: https://datasheet.ciiva.com/7983/1018594-7983486.pdf?src-supplier=Element14; ComponentLink4URL: https://datasheet.ciiva.com/22747/1018594-22747512.pdf?src-supplier=Element14; ComponentLink4Description: https://datasheet.ciiva.com/22747/1018594-22747512.pdf?src-supplier=Element14; ComponentLink5URL: https://datasheet.ciiva.com/12667/pyu-rc0402-51-rohs-l-6-r-12667067.pdf?src-supplier=Mouser; ComponentLink5Description: https://datasheet.ciiva.com/12667/pyu-rc0402-51-rohs-l-6-r-12667067.pdf?src-supplier=Mouser; ComponentLink6URL: https://datasheet.ciiva.com/7849/1784430-7849813.pdf?src-supplier=Element14; ComponentLink6Description: https://datasheet.ciiva.com/7849/1784430-7849813.pdf?src-supplier=Element14; ComponentLink7URL: https://datasheet.ciiva.com/7849/1784430-7849815.pdf?src-supplier=Element14; ComponentLink7Description: https://datasheet.ciiva.com/7849/1784430-7849815.pdf?src-supplier=Element14; Supplier Part Number 1: 603-RC0402FR-0710KL; LCSC Part Number: C60490
SW2 = TC-6615-9.5-260G: Tactile Switch SPST 260gf 9.5mm 6mm x 6mm Through Hole, Right Angle; Manufacturer: HCTL; Manufacturer Part Number: TC-6615-9.5-260G; LCSC Part Number: C2845278; Item Type: Tactile Switch; Package: Through Hole,Right Angle-4P,6x6mm; ComponentLink1Description: LCSC Link; ComponentLink1URL: https://www.lcsc.com/product-detail/C2845278.html
SW3 SW4 = B3U-1000P: SWITCH TACTILE SPST-NO 0.05A 12V; Manufacturer: Omron; Mechanical Life: 200000Cycles; Operating Force: 1.5N; Throw Configuration: SPST; Current Rating: 50mA; Contact Resistance: 100mR; Illumination Type: Non-Illuminated,Illuminated; Switch Travel: 0.15mm; Switch Function: Off-Mom; Actuator Type: Standard; Actuator Length: 0.4mm; Ratings: Dust Proof,IP40; ComponentLink1URL: http://www.farnell.com/datasheets/60838.pdf?src-supplier=Farnell; ComponentLink1Description: http://www.farnell.com/datasheets/60838.pdf?src-supplier=Farnell; ComponentLink2URL: http://www.farnell.com/datasheets/60838.pdf?src-supplier=Element14; ComponentLink2Description: http://www.farnell.com/datasheets/60838.pdf?src-supplier=Element14; ComponentLink3URL: https://omronfs.omron.com/en_US/ecb/products/pdf/en-b3u.pdf?src-supplier=Digi-Key; ComponentLink3Description: https://omronfs.omron.com/en_US/ecb/products/pdf/en-b3u.pdf?src-supplier=Digi-Key; ComponentLink4URL: http://www.omron.com/ecb/products/pdf/en-b3u.pdf?src-supplier=Digi-Key; ComponentLink4Description: http://www.omron.com/ecb/products/pdf/en-b3u.pdf?src-supplier=Digi-Key; ComponentLink5URL: https://www.distrelec.biz/Web/Downloads/he/et/B3U_eng_datasheet.pdf?mime=application%2Fpdf&src-supplier=Distrelec; ComponentLink5Description: https://www.distrelec.biz/Web/Downloads/he/et/B3U_eng_datasheet.pdf?mime=application%2Fpdf&src-supplier=Distrelec; ComponentLink6URL: http://www.onlinecomponents.com/productFiles/mf-OM/en-b3u.pdf?src-supplier=Onlinecomponents.com; ComponentLink6Description: http://www.onlinecomponents.com/productFiles/mf-OM/en-b3u.pdf?src-supplier=Onlinecomponents.com; Supplier 1: Digi-Key; Manufacturer Part Number: B3U-1000P; Stock 1: 116454; Pricing 1: 1=1, 10=0.961, 25=0.9064, 50=0.7976, 100=0.7251, 250=0.68888, 500=0.67074, 1000=0.52571 (USD); Mount: Surface Mount; Weight: 0.000776oz; Contact Material: Silver; Min Operating Temperature: -25°C; Max Operating Temperature: 70°C; Packaging: Tape and Reel; Voltage Rating (DC): 12V; Package Quantity: 1; Max Current Rating: 50mA; Termination: SMD/SMT; Orientation: Straight; Max Voltage Rating (DC): 12V; Electrical Life: 200000Cycles; Insulation Resistance: 100MR; Contact Current Rating: 50mA; Length: 4mm; Height: 1.2mm; Depth: 2.5mm; Width: 3mm; REACH SVHC: Unknown; Lead Free: Lead Free; ComponentLink7URL: https://www.verical.com/server-webapp/html/getDatasheet?partID=552554&src-supplier=Verical; ComponentLink7Description: https://www.verical.com/server-webapp/html/getDatasheet?partID=552554&src-supplier=Verical; ComponentLink8URL: http://www.farnell.com/datasheets/1685550.pdf?src-supplier=Element14; ComponentLink8Description: http://www.farnell.com/datasheets/1685550.pdf?src-supplier=Element14; ComponentLink9URL: http://www.farnell.com/datasheets/2610940.pdf?src-supplier=Farnell; ComponentLink9Description: http://www.farnell.com/datasheets/2610940.pdf?src-supplier=Farnell; ComponentLink10URL: https://www.alliedelec.com/m/d/4c8a9ef82804fc3c241a13c1e298fd73.pdf?src-supplier=Allied+Electronics; ComponentLink10Description: https://www.alliedelec.com/m/d/4c8a9ef82804fc3c241a13c1e298fd73.pdf?src-supplier=Allied+Electronics; Supplier Part Number 1: SW1020DKR-ND; LCSC Part Number: C231329; Item Type: Switch
U1 = TCA9555RTWR: Remote 16-Bit I2C and SMBus I/O Expander with Interrupt Output and Configuration Registers, 1.65 to 5.5 V, -40 to 85 degC, 24-pin QFN (RTW), Green (RoHS & no Sb/Br); Manufacturer: Texas Instruments; I2C Address: 0100 xxx; Item Type: IO Expander; ComponentLink1Description: Datasheet; DatasheetVersion: SCPS200A; Eco-Plan: Green (RoHS & no Sb/Br); Manufacturer Part Number: TCA9555RTWR; ComponentLink1URL: http://www.ti.com/general/docs/lit/getliterature.tsp?genericPartNumber=TCA9555&fileType=pdf; LCSC Part Number: C140277; Package: WQFN-24-EP(4x4); ComponentLink3Description: LCSC Link; ComponentLink3URL: https://www.lcsc.com/product-detail/C140277.html?s_z=n_TCA9555
U6 = ESP32-WROOM-32E-N4: RX TXRX MOD WIFI TRACE ANT SMD; Manufacturer: Espressif Systems; Supplier 1: Digi-Key; Manufacturer Part Number: ESP32-WROOM-32E-N4; RoHS: No; Pricing 1: 1=3.00000 (USD); Supplier Part Number 1: 1965-ESP32-WROOM-32E(4MB)CT-ND; LCSC Part Number: C701341; ComponentLink1Description: LCSC Link; ComponentLink1URL: https://lcsc.com/product-detail/WiFi-Modules_ESPRESSIF-ESP32-WROOM-32E-N4_C701341.html
U7 = UMH3N: 2 NPN pre-biased (Dual) 150mW 100mA 50V SC-70-6(SOT-363) Digital Transistors ROHS; Manufacturer: Changjiang; Manufacturer Part Number: UMH3N; Footprint: SC-70-6(SOT-363); ComponentLink1Description: LCSC; ComponentLink1URL: https://www.lcsc.com/product-detail/Digital-Transistors_Jiangsu-Changjing-Electronics-Technology-Co-Ltd-UMH3N_C62892.html; LCSC Part Number: C62892; Item Type: Transistor
U9 = CH340C: 2Mbps Transceiver USB 2.0 SOP-16 USB ICs ROHS; Manufacturer: WCH; Item Type: IC; Manufacturer Part Number: CH340C; Package: SOP-16; LCSC Part Number: C84681; ComponentLink1Description: LCSC; ComponentLink1URL: https://www.lcsc.com/product-detail/USB-ICs_WCH-Jiangsu-Qin-Heng-CH340C_C84681.html

## Sheet Display_Sheet.SchDoc
size 420 x 297 mm; SheetNumber: 6; SheetTotal: 8
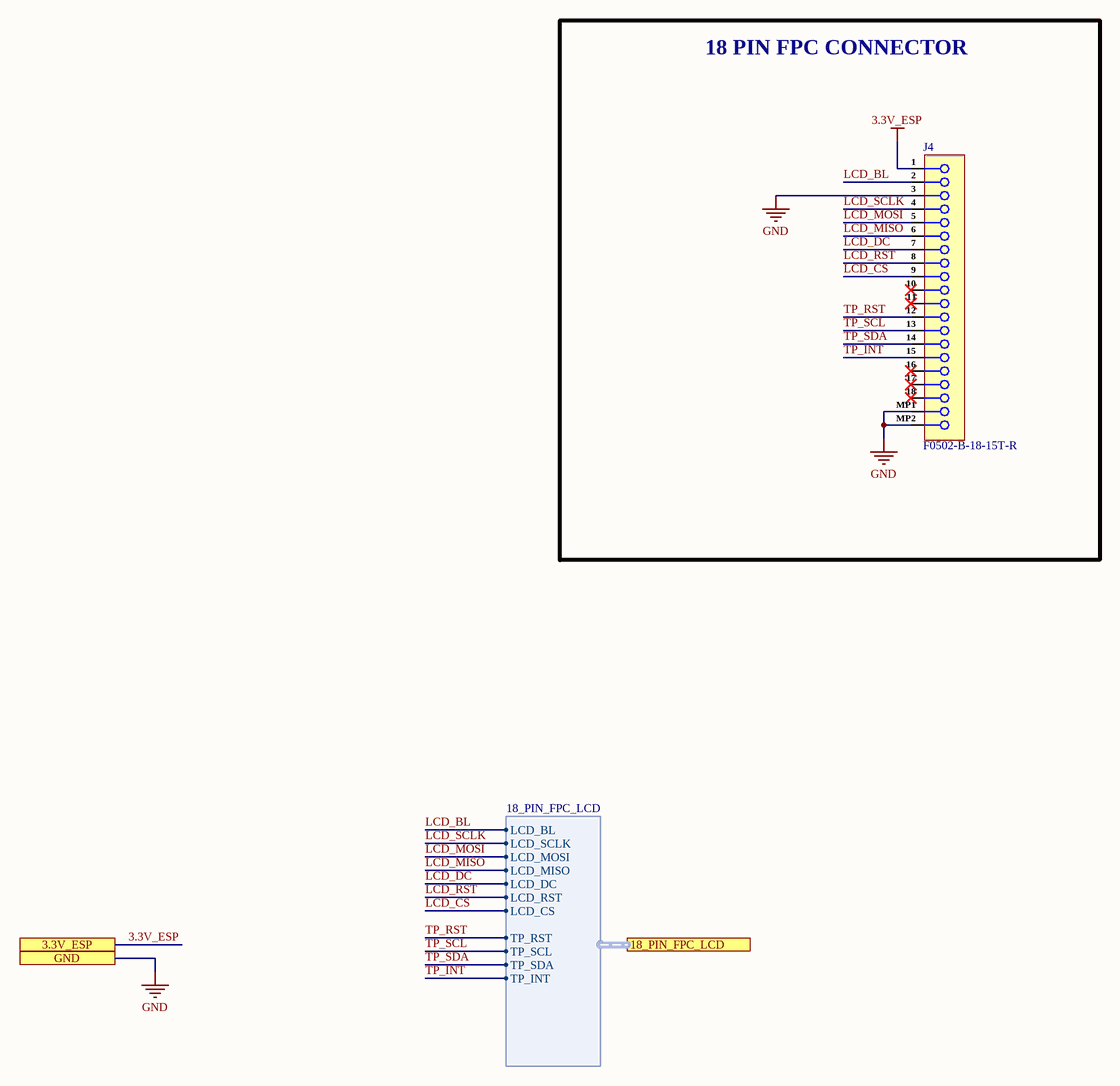
[diagram p3: Display_Sheet.SchDoc]

### Parts
J4  F0502-B-18-15T-R  [F0502-B-18-15T-R]

### Blocks framed on the sheet
18 PIN FPC CONNECTOR: J4

### Ports
3.3V_ESP (see Top_Sheet[5A], BattCharging_Sheet[2D], Controller_Sheet[3D], Ethernet_Sheet[4D], FuelGauge_Sheet[2C], Power_Sheet[1D]), 18_PIN_FPC_LCD (harness 18_PIN_FPC_LCD, see Top_Sheet[5B], Controller_Sheet[1D]), GND (see Top_Sheet[5B], BattCharging_Sheet[2D], Controller_Sheet[3D], Ethernet_Sheet[4D], FuelGauge_Sheet[2C], Power_Sheet[1D], USB_Sheet[3C])

### Harnesses
18_PIN_FPC_LCD: LCD_BL, LCD_SCLK, LCD_MOSI, LCD_MISO, LCD_DC, LCD_RST, LCD_CS, TP_RST, TP_SCL, TP_SDA, TP_INT

### Nets
3.3V_ESP: J4.1 ; port 3.3V_ESP
GND: J4.3 J4.MP1 J4.MP2 ; port GND
LCD_BL: J4.2 ; port 18_PIN_FPC_LCD.LCD_BL
LCD_CS: J4.9 ; port 18_PIN_FPC_LCD.LCD_CS
LCD_DC: J4.7 ; port 18_PIN_FPC_LCD.LCD_DC
LCD_MISO: J4.6 ; port 18_PIN_FPC_LCD.LCD_MISO
LCD_MOSI: J4.5 ; port 18_PIN_FPC_LCD.LCD_MOSI
LCD_RST: J4.8 ; port 18_PIN_FPC_LCD.LCD_RST
LCD_SCLK: J4.4 ; port 18_PIN_FPC_LCD.LCD_SCLK
TP_INT: J4.15 ; port 18_PIN_FPC_LCD.TP_INT
TP_RST: J4.12 ; port 18_PIN_FPC_LCD.TP_RST
TP_SCL: J4.13 ; port 18_PIN_FPC_LCD.TP_SCL
TP_SDA: J4.14 ; port 18_PIN_FPC_LCD.TP_SDA

Not connected (* = marked no-connect by the designer): J4 10* 11* 16* 17* 18*

### Notes on the sheet
- PROJECT
- TITLE
- DATE
- FILE NAME
- A3
- SIZE
- ENGINEER
- SHEET
- REV
- OF

### Library data of the parts
J4 = F0502-B-18-15T-R: Clamshell -25℃~+85℃ 18P Bottom Contact Surface Mount 0.5mm SMD,P=0.5mm FFC/FPC Connectors ROHS; Manufacturer: XFCN; Manufacturer Part Number: F0502-B-18-15T-R; Package: SMD,P=0.5mm; LCSC Part Number: C2889974; Item Type: FPC Connector; ComponentLink1Description: LCSC; ComponentLink1URL: https://www.lcsc.com/product-detail/FFC-FPC-Connectors_XFCN-F0502-B-18-15T-R_C2889974.html